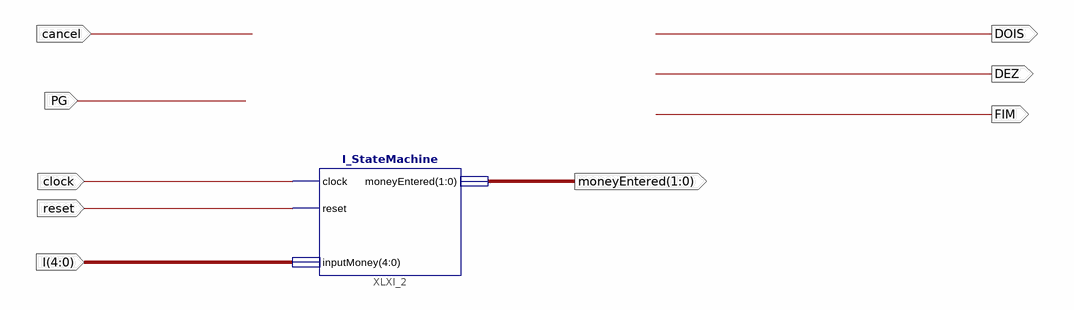
[diagram p0: schematic sheet 1]
// Xilinx ISE schematic HardCodedSchematic.sch (artix7) as structural Verilog: 1 symbols, 9 ports
module HardCodedSchematic (
  input  clock,
  input  reset,
  input  PG,
  input  [4:0] I,
  input  cancel,
  output FIM,
  output DEZ,
  output DOIS,
  output [1:0] moneyEntered
);

  I_StateMachine XLXI_2 (.clock(clock), .reset(reset), .moneyEntered(moneyEntered), .inputMoney(I));
endmodule
